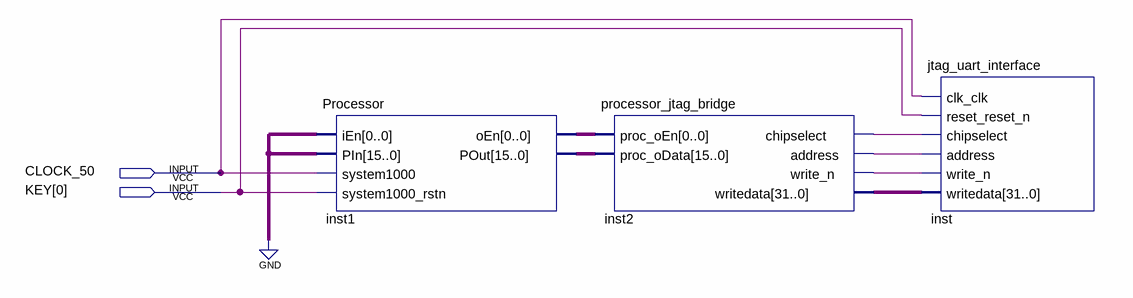
[diagram p0: schematic sheet]
// Quartus schematic hello_world.bdf as structural Verilog: 3 symbols, 2 pins
module hello_world (
  input  CLOCK_50,
  input  [0:0] KEY
);

  wire inst1_oen, inst2_address, inst2_chipselect, inst2_write_n;
  wire [15:0] inst1_pout;
  wire [31:0] inst2_writedata;

  Processor inst1 (
    .iEn({16{1'b0}}), .PIn({16{1'b0}}), .system1000(CLOCK_50), .system1000_rstn(KEY[0]), .oEn(inst1_oen),
    .POut(inst1_pout));
  processor_jtag_bridge inst2 (
    .proc_oEn(inst1_oen), .proc_oData(inst1_pout), .chipselect(inst2_chipselect), .address(inst2_address),
    .write_n(inst2_write_n), .writedata(inst2_writedata));
  jtag_uart_interface inst (
    .clk_clk(CLOCK_50), .reset_reset_n(KEY[0]), .chipselect(inst2_chipselect), .address(inst2_address),
    .write_n(inst2_write_n), .writedata(inst2_writedata));
endmodule
